# EAGLE design RF Duinode V3 (EAGLE 6.5.0)
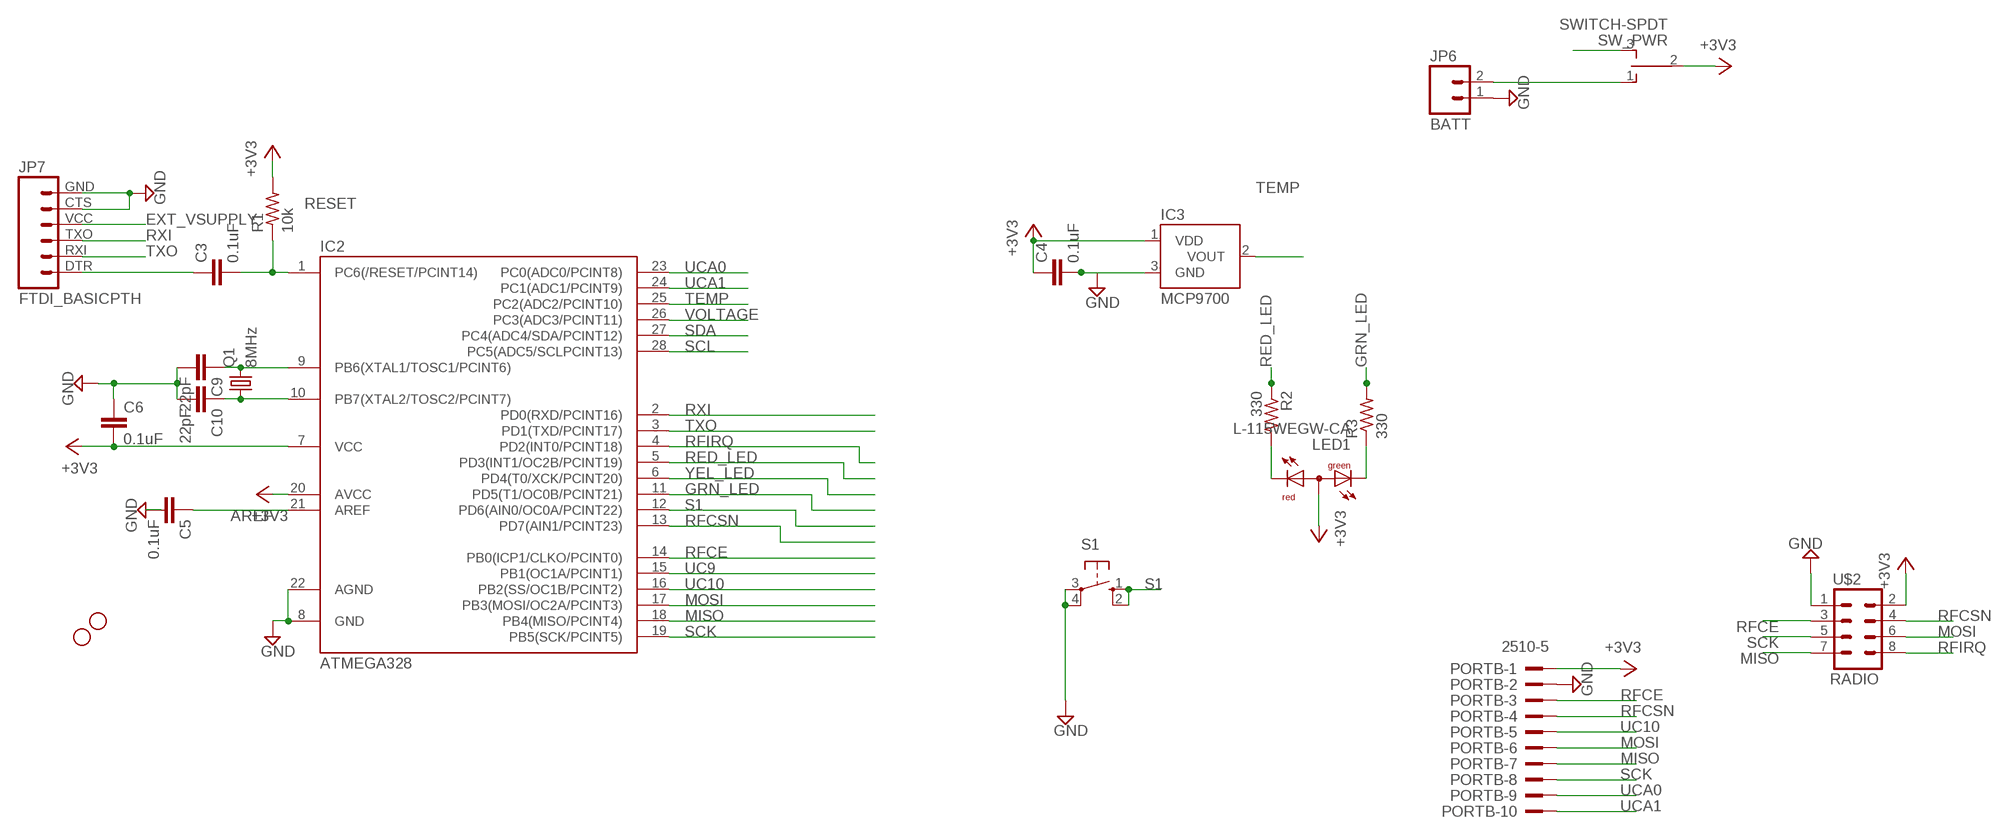
[diagram p0: schematic, sheet 1]

## Parts
C3  0.1uF  C-EU025-025X050  [C025-025X050]
C4  0.1uF  C-EU025-025X050  [C025-025X050]
C5  0.1uF  C-EU025-025X050  [C025-025X050]
C6  0.1uF  C-EU025-025X050  [C025-025X050]
C9  22pF  C-EU025-025X050  [C025-025X050]
C10  22pF  C-EU025-025X050  [C025-025X050]
IC2  ATMEGA328  ATMEGA48/88/168-PU  [DIL28-3]
IC3  MCP9700  [TO-92]
JP2  STAND-OFF  [STAND-OFF]
JP6  BATT  M02LOCK  [1X02_LOCK]
JP7  FTDI_BASICPTH  [FTDI_BASIC]
JP8  STAND-OFF  [STAND-OFF]
LED1  L-115WEGW-CA  [DUOLED-A-3MM]
PORTB  2510-5  [PAK100/2500-5-10]
Q1  8MHz  CRYSTALHC49S  [HC49/S]
R1  10k  R-US_0204/2V  [0204V]
R2  330  R-US_0204/2V  [0204V]
R3  330  R-US_0204/2V  [0204V]
S1  10-XX  [B3F-10XX]
SW_PWR  SWITCH-SPDT  [OS102011MS2QN1]
U$2  RADIO  M04X2  [2X4]

## Nets
+3V3: C4.1 C6.2 IC2.7(VCC) IC2.20(AVCC) IC3.1(VDD) LED1.2(A) PORTB.1 R1.2 SW_PWR.2(P) U$2.2
AREF: C5.1 IC2.21(AREF)
BATT: JP6.2 SW_PWR.1(O)
DTR: C3.1 JP7.DTR
EXT_VSUPPLY: JP7.VCC SW_PWR.3(S)
GND: C4.2 C5.2 C6.1 C9.2 C10.2 IC2.8(GND) IC2.22(AGND) IC3.3(GND) JP6.1 JP7.CTS JP7.GND PORTB.2 S1.3(P) S1.4(P1) U$2.1
GRN_LED: IC2.11(PD5(T1/OC0B/PCINT21)) R3.2
MISO: IC2.18(PB4(MISO/PCINT4)) PORTB.7 U$2.7
MOSI: IC2.17(PB3(MOSI/OC2A/PCINT3)) PORTB.6 U$2.6
N$1: LED1.3(CR) R2.2
N$3: LED1.1(CG) R3.1
RED_LED: IC2.5(PD3(INT1/OC2B/PCINT19)) R2.1
RESET: C3.2 IC2.1(PC6(/RESET/PCINT14)) R1.1
RFCE: IC2.14(PB0(ICP1/CLKO/PCINT0)) PORTB.3 U$2.3
RFCSN: IC2.13(PD7(AIN1/PCINT23)) PORTB.4 U$2.4
RFIRQ: IC2.4(PD2(INT0/PCINT18)) U$2.8
RXI: IC2.2(PD0(RXD/PCINT16)) JP7.TXO
S1: IC2.12(PD6(AIN0/OC0A/PCINT22)) S1.1(S) S1.2(S1)
SCK: IC2.19(PB5(SCK/PCINT5)) PORTB.8 U$2.5
SCL: IC2.28(PC5(ADC5/SCLPCINT13))
SDA: IC2.27(PC4(ADC4/SDA/PCINT12))
TEMP: IC2.25(PC2(ADC2/PCINT10)) IC3.2(VOUT)
TXO: IC2.3(PD1(TXD/PCINT17)) JP7.RXI
UC9: IC2.15(PB1(OC1A/PCINT1))
UC10: IC2.16(PB2(SS/OC1B/PCINT2)) PORTB.5
UCA0: IC2.23(PC0(ADC0/PCINT8)) PORTB.9
UCA1: IC2.24(PC1(ADC1/PCINT9)) PORTB.10
VOLTAGE: IC2.26(PC3(ADC3/PCINT11))
XTAL1: C9.1 IC2.9(PB6(XTAL1/TOSC1/PCINT6)) Q1.2
XTAL2: C10.1 IC2.10(PB7(XTAL2/TOSC2/PCINT7)) Q1.1
YEL_LED: IC2.6(PD4(T0/XCK/PCINT20))

## Library data of the parts
C3-C6 C9 C10 = resistor:C-EU: CAPACITOR, European symbol
IC2 = atmega8:ATMEGA48/88/168-PU
IC3 = JC:MCP9700
JP2 JP8 = SparkFun:STAND-OFF: Stand Off This is the mechanical footprint for a #4 phillips button head screw. Use the keepout ring to avoid running the screw head into surrounding components. SKU : PRT-00447
JP6 = SparkFun:M02: Header 2 Standard 2-pin 0.1" header. Use with straight break away headers (SKU : PRT-00116), right angle break away headers (PRT-00553), swiss pins (PRT-00743), machine pins (PRT-00117), and female headers (PRT-00115). Molex polarized connector foot print use with SKU : PRT-08233 with associated crimp pins and housings.
JP7 = SparkFun:FTDI_BASIC: FTDI Basic: 3.3V and 5V
LED1 = led:L-115WEGW-CA: T-1(3mm) BI-COLOR INDICATOR LAMP Source: Kingbright .. 2_colour_led_.pdf
PORTB = con-3m:2510-: 3M (TM) Pak 100 4-Wall Header Source: 3M
Q1 = crystal:CRYSTAL: CRYSTAL
R1-R3 = resistor:R-US_: RESISTOR, American symbol
S1 = switch-omron:10-XX: OMRON SWITCH; MPN: B3F-1000; OC_FARNELL: 176432; OC_NEWARK: 36M3542
SW_PWR = JC:SWITCH-SPDT: TINY SWITCH ON OFF ON Source: http://www2.produktinfo.conrad.com/datenblaetter/700000-724999/705152-da-01-de-Subminiaturschalter_TL_36YO.pdf
U$2 = SparkFun:M04X2

## Net classes
0 default: width 0.203 mm, drill 0.33 mm, clearance 0.203 mm

## Board
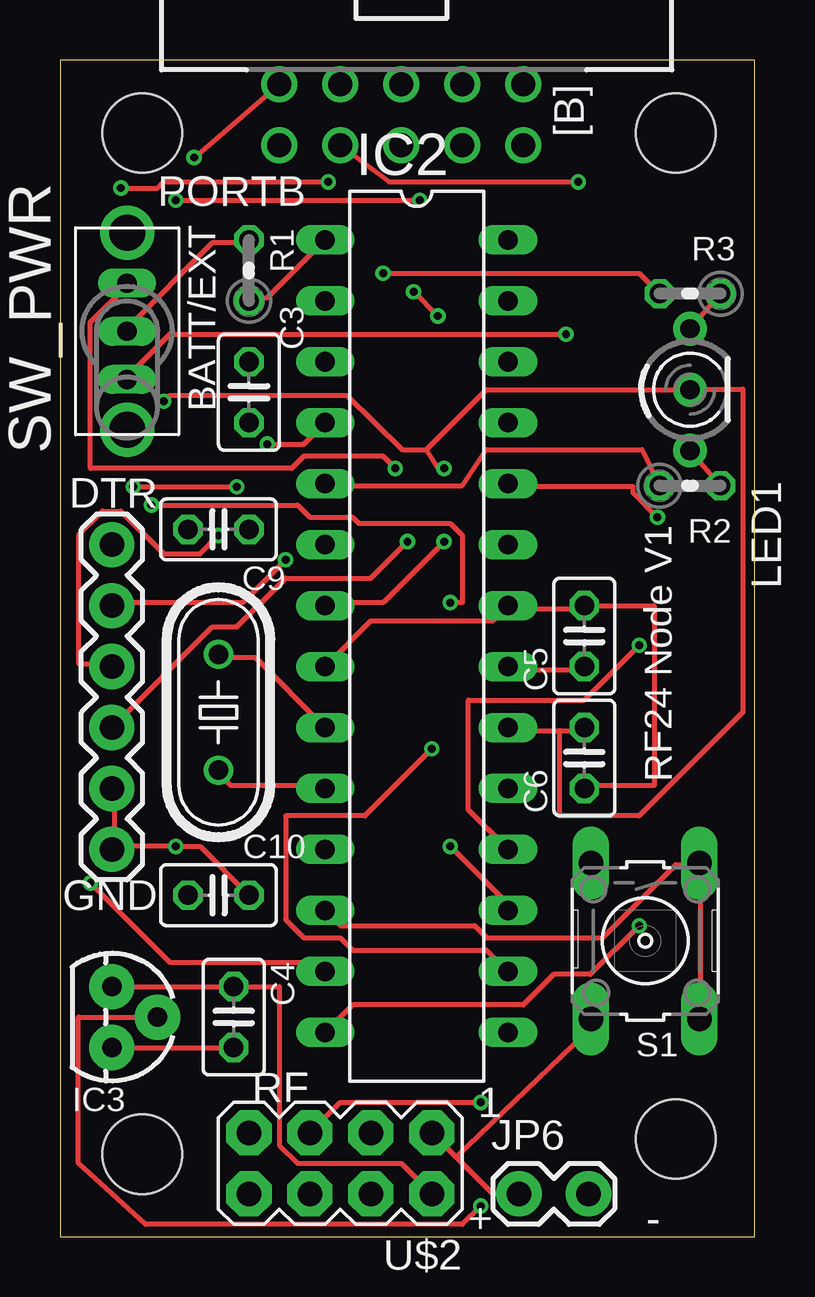
[diagram p1: board, top side]
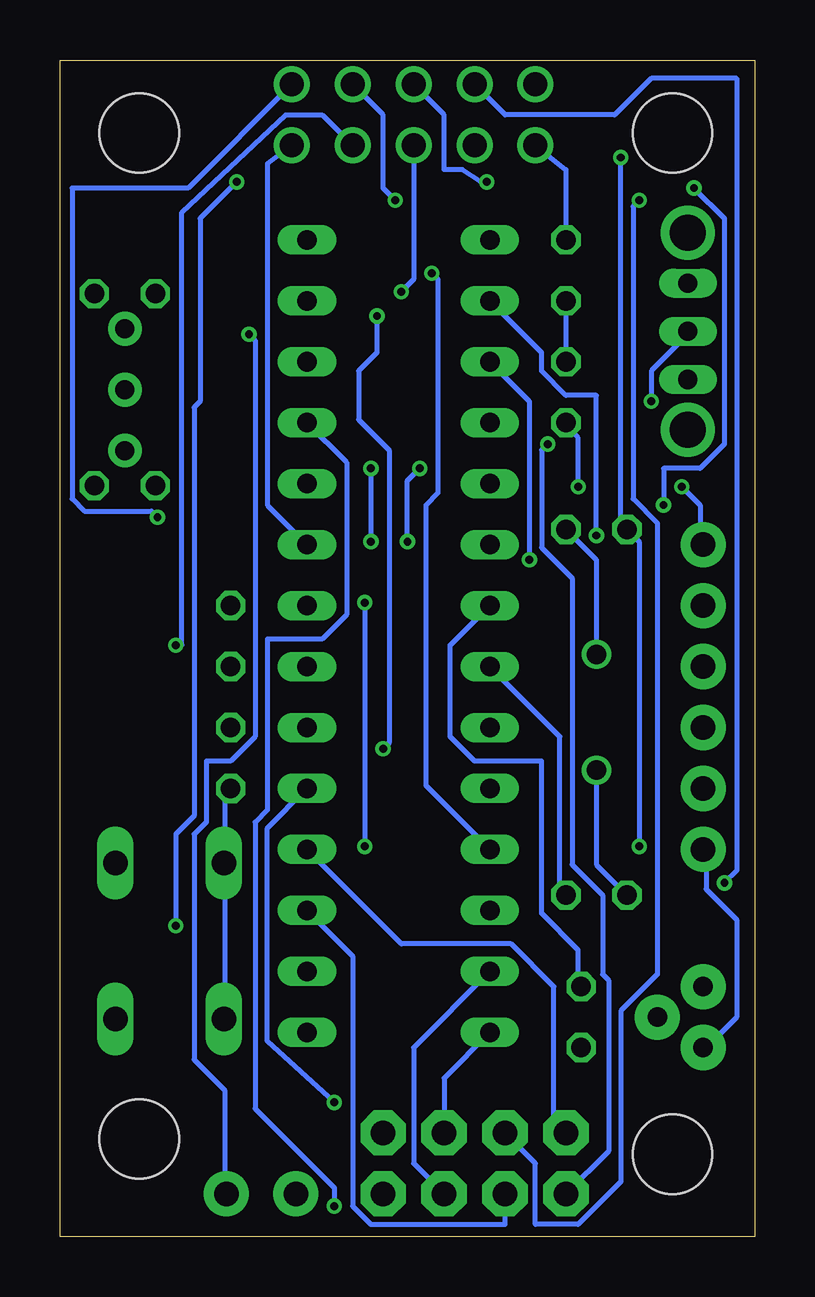
[diagram p2: board, bottom side, seen from below]

Size 28.96 x 49.02 mm. Coordinates in mm from the lower left corner, seen from the top.
Outline: 0,0 28.96,0 28.96,49.02 0,49.02 0,0
Copper layers (1*2*15*16): Top 0.035mm / dielectric 0.2mm / layer 2 0.0175mm / dielectric 1.1mm / layer 15 0.0175mm / dielectric 0.2mm / Bottom 0.035mm
Design rules "SeeedStudio_DRU_no_angle_20130527": minimum track width 6mil, minimum drill 12mil, track to track 6mil, track to pad 6mil, pad to pad 6mil, via to via 6mil, smd to smd 0mil, copper to edge 10mil, drill to drill 10mil, minimum pad ring 6mil, minimum via ring 6mil, stop-mask expansion 2mil, vias tented up to drill 25mil, thermal gap 10mil

### Footprints (pad centres in the part's own frame; a part is rotated, then mirrored left to right if it is on the bottom)
C025-025X050 = drill 0.813 octagon: 1 -1.27,0; 2 1.27,0
DIL28-3 = drill 0.813 long: 1 -16.51,-3.81; 2 -13.97,-3.81; 3 -11.43,-3.81; 4 -8.89,-3.81; 5 -6.35,-3.81; 6 -3.81,-3.81; 7 -1.27,-3.81; 8 1.27,-3.81; 9 3.81,-3.81; 10 6.35,-3.81; 11 8.89,-3.81; 12 11.43,-3.81; 13 13.97,-3.81; 14 16.51,-3.81; 15 16.51,3.81; 16 13.97,3.81; 17 11.43,3.81; 18 8.89,3.81; 19 6.35,3.81; 20 3.81,3.81; 21 1.27,3.81; 22 -1.27,3.81; 23 -3.81,3.81; 24 -6.35,3.81; 25 -8.89,3.81; 26 -11.43,3.81; 27 -13.97,3.81; 28 -16.51,3.81
TO-92 = drill 0.813 pad 1.88: 1 -1.27,0; 2 0,1.905; 3 1.27,0
STAND-OFF = hole 3.302: 0,0
1X02_LOCK = drill 1.016 pad 1.88: 1 -0.178,0; 2 2.718,0
FTDI_BASIC = drill 1.016 pad 1.88: CTS 10.16,0; DTR 0,0; GND 12.7,0; RXI 2.54,0; TXO 5.08,0; VCC 7.62,0
DUOLED-A-3MM = drill 0.8 pad 1.4: 1 -2.54,0; 2 0,0; 3 2.54,0
PAK100/2500-5-10 = drill 1 pad 1.422: 1 -5.08,-1.27; 2 -5.08,1.27; 3 -2.54,-1.27; 4 -2.54,1.27; 5 0,-1.27; 6 0,1.27; 7 2.54,-1.27; 8 2.54,1.27; 9 5.08,-1.27; 10 5.08,1.27
HC49/S = drill 0.813: 1 -2.413,0; 2 2.413,0
0204V = drill 0.813 octagon: 1 -1.27,0; 2 1.27,0
B3F-10XX = drill 1.016 long: 1 -3.251,2.261; 2 3.251,2.261; 3 -3.251,-2.261; 4 3.251,-2.261
OS102011MS2QN1 = drill 0.8 pad 1.016 long: 1 -2.007,0; 2 0,0; 3 2.007,0 | drill 1.5 pad 1.778: M1 -4.102,0; M2 4.102,0
2X4 = drill 1.016 pad 1.88 octagon: 1 -3.81,-1.27; 2 -3.81,1.27; 3 -1.27,-1.27; 4 -1.27,1.27; 5 1.27,-1.27; 6 1.27,1.27; 7 3.81,-1.27; 8 3.81,1.27

### Placement (x,y rotation side)
C3  7.87,35.18 90 top
C4  7.24,9.14 270 top
C5  21.84,25.02 90 top
C6  21.84,19.94 90 top
C9  6.6,29.46 180 top
C10  6.6,14.22 0 top
IC2  14.86,25.02 270 top
IC3  2.16,9.14 270 top
JP1  STAND-OFF  [STAND-OFF]  25.65,4.06 270 top
JP2  3.43,45.97 270 top
JP6  19.3,1.78 0 top
JP7  2.16,28.83 270 top
JP8  25.65,45.97 270 top
JP9  STAND-OFF  [STAND-OFF]  3.43,3.43 270 top
LED1  26.25,35.28 270 top
PORTB  14.22,46.74 0 top
Q1  6.6,21.84 90 top
R1  7.87,40.26 90 top
R2  26.25,31.28 0 top
R3  26.25,39.28 180 top
S1  24.38,12.32 270 top
SW_PWR  2.79,37.72 90 top
U$2  11.68,3.05 180 top

### Tracks (layer width: path | path; a pad name or v marks a point on that pad's centre or on a via)
+3V3  (via drill 0.33)
  Top 0.203: SW_PWR.2 2.79,37.85 6.35,41.4 7.87,41.4 R1.2 | LED1.2 17.75,35.28 15.25,32.78 | LED1.2 26.42,35.28 | 26.42,35.28 26.75,35.28 | 15.25,32.78 14.25,32.78 11.94,35.05 4.57,35.05 v4.32,34.8 | IC3.1 C4.1 9.14,10.41 9.14,3.81 9.91,3.05 14.22,3.05 U$2.2 | 20.83,21.08 18.8,21.08 IC2.20 | 20.83,21.08 21.84,21.08 C6.2 | 15.25,32.78 15.75,32 v16,32 | v16,28.96 13.46,26.42 11.18,26.42 IC2.7 | LED1.2 26.42,35.31 26.42,35.28 | 20.83,21.08 20.83,17.53 24.13,17.53 28.45,21.84 28.45,35.31 26.67,35.31 LED1.2
  Bottom 0.203: v4.32,34.8 4.32,36.07 2.79,37.59 SW_PWR.2 | PORTB.1 7.87,44.45 R1.2 | v16,32 v16,28.96 | IC2.7 12.7,24.64 12.7,20.83 11.68,19.81 8.89,19.81 8.89,13.46 7.37,11.94 7.37,10.41 C4.1
AREF
  Top 0.203: IC2.21 18.8,23.62 21.84,23.62 C5.1
BATT  (via drill 0.33)
  Top 0.203: v21.08,37.59 4.57,37.59 2.79,35.81 SW_PWR.1
  Bottom 0.203: v21.08,37.59 20.83,37.34 20.83,20.83 21.84,19.81 22.86,19.81 22.86,17.27 23.37,16.76 23.37,7.37 22.1,6.1 22.1,1.78 JP6.2
DTR  (via drill 0.33)
  Top 0.203: v3.05,31.24 v7.37,31.24
  Bottom 0.203: v7.37,31.24 7.37,33.27 7.87,33.78 C3.1 | v3.05,31.24 2.29,30.48 2.29,28.96 JP7.DTR
EXT_VSUPPLY  (via drill 0.33)
  Top 0.203: v13.97,32 13.46,32.51 10.16,32.51 9.65,32 1.27,32 1.27,38.1 2.79,39.62 SW_PWR.3 | v14.48,28.96 12.95,27.43 9.4,27.43 7.37,25.4 6.35,25.4 JP7.VCC
  Bottom 0.203: v13.97,32 14.48,31.5 v14.48,28.96
GND  (via drill 0.33)
  Top 0.203: 21.84,26.16 18.8,26.16 IC2.22 18.03,25.65 12.95,25.65 IC2.8 | 21.84,26.16 21.75,26.28 24.75,26.28 24.75,18.78 21.75,18.78 C6.1 | 21.84,26.16 C5.2 | 16.51,3.3 18.03,1.78 JP6.1 | 16.51,3.3 U$2.1 | 16.51,3.3 22.35,8.89 S1.4 | IC3.3 C4.2 | 2.29,16.26 v4.83,16.26 5.84,16.26 C10.2 | 2.29,16.26 2.29,18.54 JP7.CTS | 2.29,16.26 JP7.GND | v5.59,44.96 PORTB.2
  Bottom 0.203: C6.1 21.84,18.54 22.1,18.29 22.1,15.75 S1.3 22.1,15.49 22.1,9.14 S1.4 | v4.83,16.26 4.83,28.96 C9.2 5.59,29.72 v5.59,44.96 | IC3.3 2.03,7.87 0.76,9.14 0.76,13.21 2.03,14.48 2.03,16 JP7.GND | C10.2 8.13,14.48 8.13,20.83 IC2.8
GRN_LED  (via drill 0.33)
  Top 0.203: v13.46,40.13 24.14,40.13 R3.2
  Bottom 0.203: v13.46,40.13 13.21,39.88 13.21,30.99 13.72,30.48 13.72,18.8 IC2.11
MISO  (via drill 0.33)
  Top 0.203: v24.13,24.64 21.84,22.35 17.02,22.35 17.02,17.78 IC2.18
  Bottom 0.203: IC2.18 14.73,12.19 10.16,12.19 8.38,10.41 8.38,4.32 U$2.7 | PORTB.7 18.03,46.74 19.56,46.74 23.88,42.67 23.88,24.64 v24.13,24.64
MOSI  (via drill 0.33)
  Top 0.203: v11.18,43.94 4.32,43.94 4.06,43.69 v2.54,43.69 | v3.81,30.48 9.91,30.48 10.41,29.97 12.19,29.97 12.45,29.72 16.26,29.72 16.76,29.21 16.76,26.42 v16.26,26.42 | v16.26,16.26 18.8,13.72 IC2.17
  Bottom 0.203: U$2.6 10.41,0.51 16,0.51 16.76,1.27 16.76,11.68 IC2.17 | v2.54,43.69 1.27,42.42 1.27,33.02 2.29,32 3.81,32 v3.81,30.48 | v16.26,26.42 v16.26,16.26 | PORTB.6 12.95,46.74 12.95,44.45 12.19,44.45 11.43,43.94 v11.18,43.94
N$1
  Top 0.203: R2.2 LED1.3
N$3
  Top 0.203: LED1.1 R3.1
RED_LED
  Top 0.203: IC2.5 12.25,31.28 16.75,31.28 17.75,32.78 24.25,32.78 R2.1
RESET
  Top 0.203: IC2.1 8.64,39.12 7.87,39.12 R1.1
  Bottom 0.203: R1.1 C3.2
RFCE  (via drill 0.33)
  Top 0.203: PORTB.3 13.72,43.94 v21.59,43.94 | v24.13,12.95 22.1,10.92 20.57,10.92 19.3,9.65 12.19,9.65 IC2.14
  Bottom 0.203: U$2.3 12.95,6.6 IC2.14 | v21.59,43.94 23.11,42.42 23.11,34.8 23.37,34.54 23.37,17.53 24.13,16.76 v24.13,12.95
RFCSN  (via drill 0.33)
  Top 0.203: v1.27,14.73 4.57,11.43 10.67,11.43 IC2.13
  Bottom 0.203: U$2.4 14.22,3.05 14.22,7.87 IC2.13 | v1.27,14.73 0.76,15.24 0.76,48.26 4.32,48.26 5.84,46.74 10.41,46.74 PORTB.4
RFIRQ  (via drill 0.33)
  Top 0.203: v8.64,33.02 10.16,33.02 IC2.4
  Bottom 0.203: v8.64,33.02 8.89,32.77 8.89,28.7 7.62,27.43 7.62,15.49 6.35,14.22 6.35,10.92 6.1,10.67 6.1,3.56 U$2.8
RXI  (via drill 0.33)
  Top 0.203: v6.6,29.21 5.84,28.45 4.32,28.45 2.54,30.23 1.78,30.23 0.76,29.21 0.76,23.88 2.03,23.88 JP7.TXO
  Bottom 0.203: v6.6,29.21 6.6,35.05 7.87,35.05 8.89,36.07 8.89,36.83 IC2.2
S1
  Top 0.203: IC2.12 11.68,12.95 17.27,12.95 17.78,12.45 22.61,12.45 25.65,15.49 26.42,15.49 S1.1 26.67,15.49 26.67,9.14 S1.2
SCK  (via drill 0.33)
  Top 0.203: v17.53,5.59 11.68,5.59 U$2.5 | v4.83,43.18 v14.99,43.18
  Bottom 0.203: v17.53,5.59 20.32,8.13 20.32,17.02 IC2.19 | PORTB.8 15.49,46.74 15.49,43.69 v14.99,43.18 | v4.83,43.18 5.08,42.93 5.08,30.73 4.06,29.72 4.06,10.92 5.59,9.4 5.59,2.29 7.37,0.51 9.14,0.51 9.14,3.05 U$2.5
TEMP  (via drill 0.33)
  Top 0.203: v17.53,1.27 16.76,0.51 3.56,0.51 0.76,3.05 0.76,9.14 IC3.2
  Bottom 0.203: v17.53,1.27 17.53,2.03 20.83,5.33 20.83,17.27 20.32,17.78 20.32,24.89 18.03,24.89 17.02,25.91 17.02,32.26 IC2.25
TXO  (via drill 0.33)
  Top 0.203: v9.4,28.19 7.62,26.42 2.29,26.42 JP7.RXI
  Bottom 0.203: v9.4,28.19 9.4,34.8 IC2.3
UC10  (via drill 0.33)
  Top 0.203: v15.49,20.32 12.7,17.53 9.4,17.53 9.4,13.21 10.16,12.45 11.68,12.45 12.19,11.94 17.78,11.94 IC2.16 | v14.73,39.37 v15.75,38.35
  Bottom 0.203: v15.49,20.32 15.24,20.57 15.24,32.77 16.51,34.04 16.51,36.07 15.75,36.83 v15.75,38.35 | v14.73,39.37 14.22,39.88 PORTB.5
UCA0
  Bottom 0.203: PORTB.9 20.32,44.7 20.32,30.48 IC2.23
UCA1  (via drill 0.33)
  Top 0.203: v24.89,29.97 23.88,30.99 23.88,31.24 18.8,31.24 IC2.24
  Bottom 0.203: v24.89,29.97 25.15,30.23 27.94,30.23 28.45,30.73 28.45,43.69 23.62,43.69 PORTB.10
XTAL1
  Top 0.203: IC2.9 8.13,24.13 6.6,24.13 Q1.2
  Bottom 0.203: C9.1 6.6,28.19 Q1.2
XTAL2
  Top 0.203: Q1.1 6.6,19.3 7.11,18.8 10.92,18.8 IC2.10
  Bottom 0.203: C10.1 6.6,15.49 Q1.1

### Text on the board
tPlace: [B] | BATT/EXT | DTR | RF24 Node V1 | GND | RF | 1 | + | -